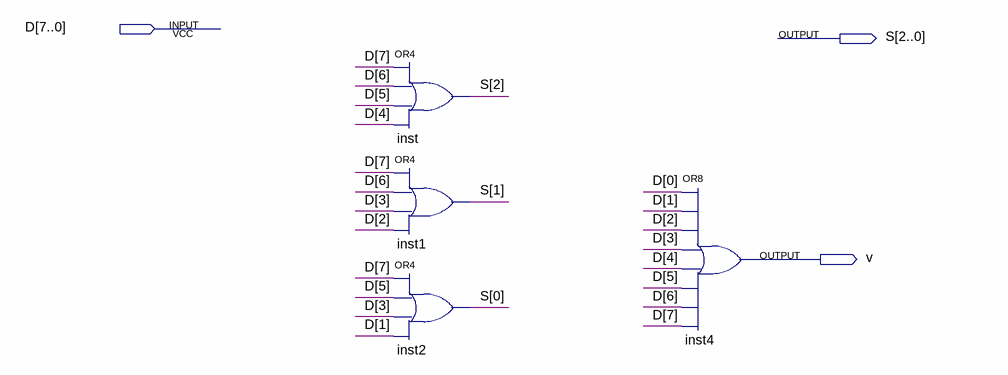
[diagram p0: schematic sheet]
// Quartus schematic ENCOD3X8.bdf as structural Verilog: 4 symbols, 3 pins
module ENCOD3X8 (
  input  [7:0] D,
  output [2:0] S,
  output v
);

  or inst (S[2], D[7], D[6], D[5], D[4]);
  or inst1 (S[1], D[7], D[6], D[3], D[2]);
  or inst2 (S[0], D[7], D[5], D[3], D[1]);
  or inst4 (v, D[0], D[1], D[2], D[3], D[4], D[5], D[6], D[7]);
endmodule
